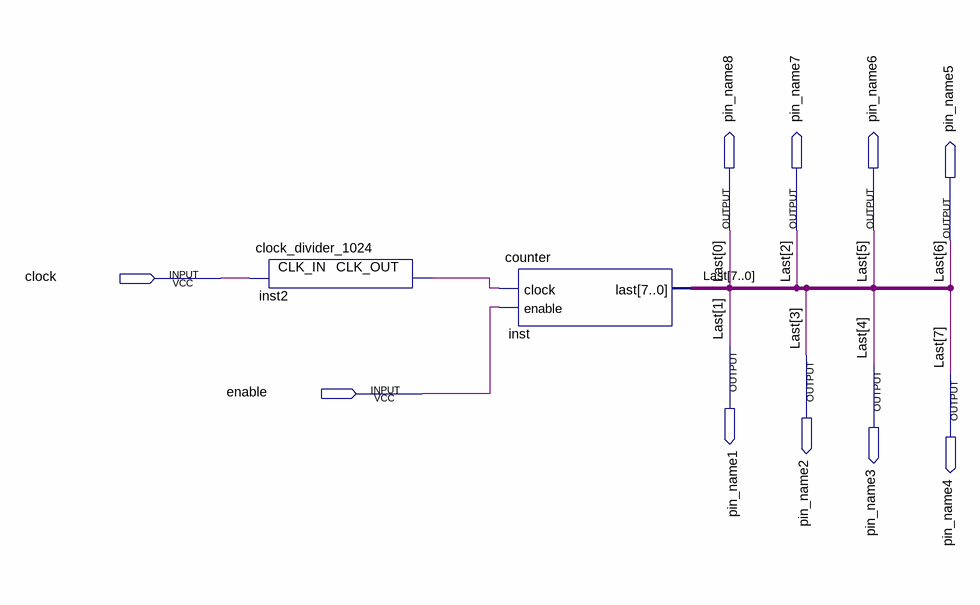
[diagram p0: schematic sheet]
// Quartus schematic test.bdf as structural Verilog: 2 symbols, 10 pins
module test (
  input  clock,
  input  enable,
  output pin_name8,
  output pin_name7,
  output pin_name6,
  output pin_name5,
  output pin_name1,
  output pin_name2,
  output pin_name3,
  output pin_name4
);

  wire inst2_clk_out;

  clock_divider_1024 inst2 (.CLK_IN(clock), .CLK_OUT(inst2_clk_out));
  counter inst (
    .clock(inst2_clk_out), .enable(enable),
    .last({pin_name4, pin_name5, pin_name6, pin_name3, pin_name2, pin_name7, pin_name1, pin_name8}));

  // Other names for the same wires on the sheet: Last[7:0] = {pin_name4, pin_name5, pin_name6, pin_name3, pin_name2, pin_name7, pin_name1, pin_name8}
endmodule
